# Altium project RadToF.PrjPcb (part 2 of 2)

## Sheet PowerSupply.SchDoc
size B; SheetNumber: 4; SheetTotal: 4
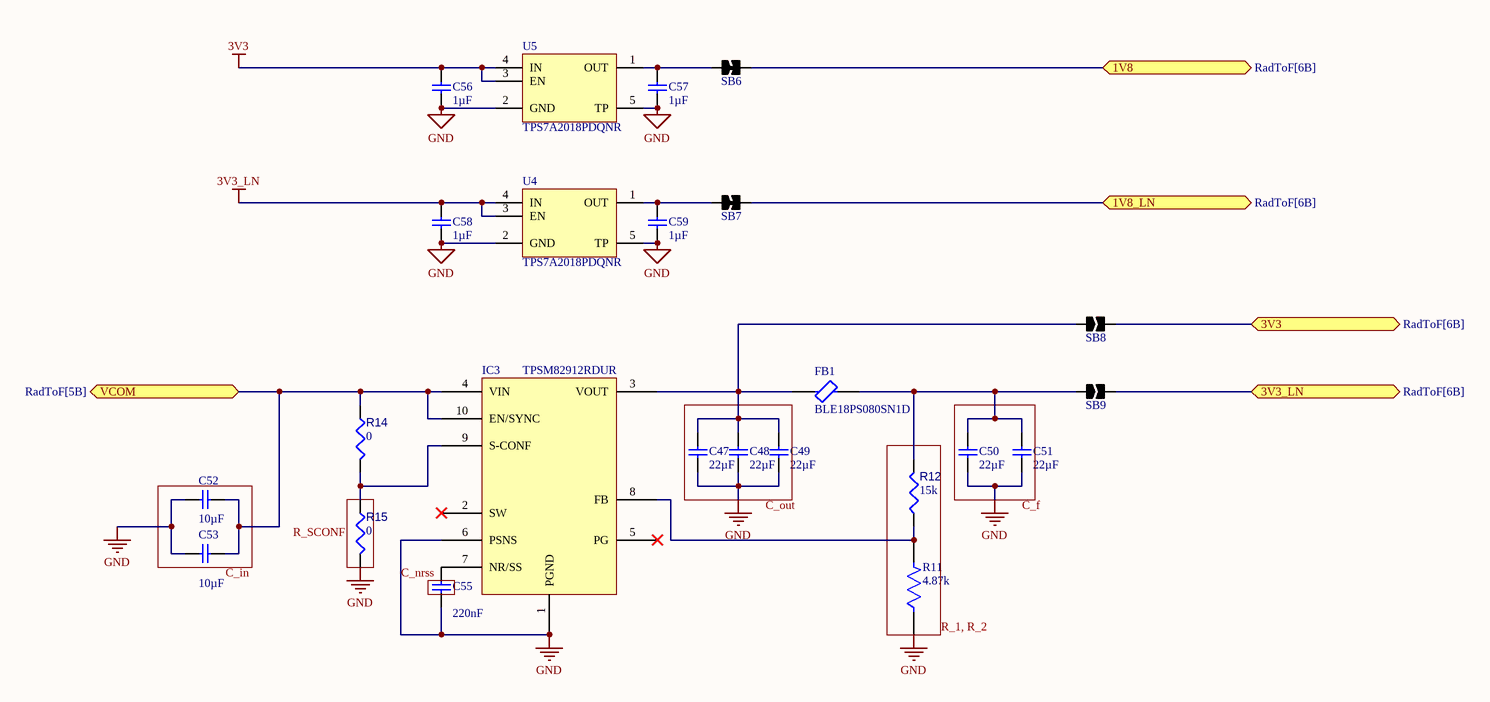
[diagram p3: PowerSupply.SchDoc]

### Parts
C47  value 22µF  [CAP0402]  (hidden comment: C_GRM158R60J226ME01D)
C48  value 22µF  [CAP0402]  (hidden comment: C_GRM158R60J226ME01D)
C49  value 22µF  [CAP0402]  (hidden comment: C_GRM158R60J226ME01D)
C50  value 22µF  [CAP0402]  (hidden comment: C_GRM158R60J226ME01D)
C51  value 22µF  [CAP0402]  (hidden comment: C_GRM158R60J226ME01D)
C52  value 10µF  [CAP0402]  (hidden comment: C_GRM155R61A106ME11D)
C53  value 10µF  [CAP0402]  (hidden comment: C_GRM155R61A106ME11D)
C55  value 220nF  [CAP0201]  (hidden comment: C_GRT033C80J224KE01D)
C56  value 1µF  [CAP0402]  (hidden comment: C_GRM155R61E105KA12J)
C57  value 1µF  [CAP0402]  (hidden comment: C_GRM155R61E105KA12J)
C58  value 1µF  [CAP0402]  (hidden comment: C_GRM155R61E105KA12J)
C59  value 1µF  [CAP0402]  (hidden comment: C_GRM155R61E105KA12J)
FB1  BLE18PS080SN1D  [FP-BLE18-0_15-t0_6-IPC_B]
IC3  TPSM82912RDUR  [TPSM82912RDUR]
R11  4.87k  [FP-RG1005-IPC_C]
R12  value 15k  [RESC1005X40X25ML10T10]  (hidden comment: Resistor 15k +/-1% 0402 63 mW)
R14  value 0  [RESC0402(1005)_L]  (hidden comment: Jumper 0402)
R15  value 0  [RESC0402(1005)_L]  (hidden comment: Jumper 0402)
SB6  SB2_0402_close  [SB2_0402_CLOSE]  (value not drawn)  (net tie)
SB7  SB2_0402_close  [SB2_0402_CLOSE]  (value not drawn)  (net tie)
SB8  SB2_0402  [SB2_0402]  (value not drawn)
SB9  SB2_0402  [SB2_0402]  (value not drawn)
U4  TPS7A2018PDQNR  [DQN0004A_V]
U5  TPS7A2018PDQNR  [DQN0004A_V]

### Ports
1V8 (bidir, see RadToF[6B]), 1V8_LN (bidir, see RadToF[6B]), 3V3 (bidir, see RadToF[6B]), 3V3_LN (bidir, see RadToF[6B]), VCOM (bidir, see RadToF[5B])

### Nets
1V8_LN: SB7.1 ; port 1V8_LN
3V3: C56.2 SB8.1 U5.3(EN) U5.4(IN) ; port 3V3  [project net AVDD]
3V3_LN: C58.2 SB9.1 U4.3(EN) U4.4(IN) ; port 3V3_LN
GND: C47.1 C48.1 C49.1 C50.1 C51.1 C52.1 C53.1 C55.1 C56.1 C57.1 C58.1 C59.1 IC3.1(PGND) IC3.6(PSNS) R11.1 R15.2 U4.2(GND) U4.5(TP) U5.2(GND) U5.5(TP)
IOVDD: SB6.1 ; port 1V8
VCOM: C52.2 C53.2 IC3.4(VIN) IC3.10(EN/SYNC) R14.1 ; port VCOM
NetC47_2: C47.2 C48.2 C49.2 FB1.1 IC3.3(VOUT) SB8.2
NetC50_2: C50.2 C51.2 FB1.2 R12.2 SB9.2
NetC55_2: C55.2 IC3.7(NR/SS)
NetC57_2: C57.2 SB6.2 U5.1(OUT)
NetC59_2: C59.2 SB7.2 U4.1(OUT)
NetIC3_8: IC3.8(FB) R11.2 R12.1
NetIC3_9: IC3.9(S-CONF) R14.2 R15.1

Not connected (* = marked no-connect by the designer): IC3 2(SW)* 5(PG)*

### Notes on the sheet
- (near R15) R_SCONF
- C_out
- C_f
- (near C53) C_in
- (near C55) C_nrss
- (near R11) R_1, R_2

### Library data of the parts
C47-C51 = CMP-001-00107-1: CAP CER 22uF 6.3V X5R 0402; Manufacturer Part Number: GRM155R71H103KA88D; Part Number: GRM033R70J103JA01D; Manufacturer: Murata Electronics; Tolerance: 5%; Capacitor Type: Ceramic; Temperature Characteristics Code: X7R; Rated DC Voltage (URdc): 50V; Multilayer: Yes; Positive Tolerance: 10%; Height: 0.5mm; ComponentLink6Description: https://datasheet.ciiva.com/129/product-129810.pdf?src-supplier=Digi-Key; Package Shape: Rectangular; Pricing 2: 1=0.54000, 10=0.38400, 50=0.38400, 100=0.25300, 1000=0.15900, 10000=0.11200 (USD); Mount: Surface Mount; Terminal Finish: Nickel; Part Status: Active; Length: 1mm; ComponentLink7Description: https://datasheet.ciiva.com/11786/0900766b80ef921d-11786340.pdf?src-supplier=RSComponents; Source: schuluka.SchLib; ComponentLink3Description: https://psearch.en.murata.com:443/capacitor/product/GRM155R71H103KA88%23.pdf?src-supplier=IHS+Markit; Min Operating Temperature: -55°C; Thickness (Max): 0.013" (0.33mm); ComponentLink13URL: https://datasheet.ciiva.com/16495/product-16495290.pdf?src-supplier=Future+Electronics; ComponentLink9Description: https://datasheet.ciiva.com/29199/454225-da-01-en-vs-kondensator-0402-29199740.pdf?src-supplier=Conrad; Size / Dimension: 0.024" L x 0.012" W (0.60mm x 0.30mm); ComponentLink4Description: https://datasheet.ciiva.com/22698/1747449-22698420.pdf?src-supplier=Element14; Width: 0.5mm; LastUpdated: 02/09/2020 01:00:04; ComponentLink10Description: https://datasheet.ciiva.com/129/grm155r71h103ka88-01-129811.pdf?src-supplier=Digi-Key; ComponentLink4URL: https://datasheet.ciiva.com/22698/1747449-22698420.pdf?src-supplier=Element14; Lifecycle Status: Active; Minimum Order: 1; ComponentLink11Description: https://datasheet.ciiva.com/129/grm155r71h103ka88-01-129812.pdf?src-supplier=Digi-Key; ComponentLink8Description: https://datasheet.ciiva.com/18100/getdatasheetpartid-27434-18100660.pdf?src-supplier=Verical; ComponentLink12URL: https://datasheet.ciiva.com/5410/product-5410990.pdf?src-supplier=Mouser; JESD-609 Code: e3; ComponentLink6URL: https://datasheet.ciiva.com/129/product-129810.pdf?src-supplier=Digi-Key; RoHS: Yes; ComponentLink2URL: http://digikey.com/product-detail/en/murata-electronics/GRM033R70J103JA01D/490-16599-1-ND/7595523; Category: Ceramic Capacitors; ComponentLink1Description: Datasheet; ComponentLink10URL: https://datasheet.ciiva.com/129/grm155r71h103ka88-01-129811.pdf?src-supplier=Digi-Key; ComponentLink2Description: DigiKey Link; Termination: Wraparound; Pins: 2; Package Style: SMTMeter; RoHS Compliant: Yes; Price: 0.10; ComponentLink1URL: https://search.murata.co.jp/Ceramy/image/img/A01X/G101/ENG/GRM033R70J103JA01-01.pdf; ComponentLink5Description: https://datasheet.ciiva.com/19476/1856433-19476546.pdf?src-supplier=Jameco; Max Operating Temperature: 125°C; ComponentLink9URL: https://datasheet.ciiva.com/29199/454225-da-01-en-vs-kondensator-0402-29199740.pdf?src-supplier=Conrad; Packaging: CutTape; ComponentLink13Description: https://datasheet.ciiva.com/16495/product-16495290.pdf?src-supplier=Future+Electronics; ComponentLink8URL: https://datasheet.ciiva.com/18100/getdatasheetpartid-27434-18100660.pdf?src-supplier=Verical; Series: GRM; ComponentLink5URL: https://datasheet.ciiva.com/19476/1856433-19476546.pdf?src-supplier=Jameco; Pricing 1: 1=0.10000, 10=0.03200, 50=0.03200, 100=0.01500, 1000=0.00800, 10000=0.00500 (USD); Operating Temperature: -55°C ~ 125°C; Design Item ID: C_GRM158R60J226ME01D; Package / Case: 0201 (0603 Metric); PartId: 174; ComponentLink11URL: https://datasheet.ciiva.com/129/grm155r71h103ka88-01-129812.pdf?src-supplier=Digi-Key; Stock 1: 3320653; Temperature Coefficient: X7R; Stock 2: 132139; ComponentLink7URL: https://datasheet.ciiva.com/11786/0900766b80ef921d-11786340.pdf?src-supplier=RSComponents; ComponentLink3URL: https://psearch.en.murata.com:443/capacitor/product/GRM155R71H103KA88%23.pdf?src-supplier=IHS+Markit; REACH SVHC: Yes; Applications: General Purpose; ComponentLink12Description: https://datasheet.ciiva.com/5410/product-5410990.pdf?src-supplier=Mouser; Negative Tolerance: 10%; Voltage - Rated: 6.3V; Size Code: 0402; Device Package: 0201 (0603 Metric); Mounting Type: Surface Mount, MLCC; Dielectric Material: Ceramic
C52 C53 = CMP-001-00100-1: CAP CER  10uF 10V X5R 20% 0402; Manufacturer: Murata Electronics; Part Number: GRM033R70J103JA01D; Manufacturer Part Number: GRM155R71H103KA88D; Tolerance: 5%; Rated DC Voltage (URdc): 50V; Voltage - Rated: 6.3V; Temperature Coefficient: X7R; Dielectric Material: Ceramic; Negative Tolerance: 10%; Multilayer: Yes; ComponentLink6Description: https://datasheet.ciiva.com/129/product-129810.pdf?src-supplier=Digi-Key; ComponentLink2URL: http://digikey.com/product-detail/en/murata-electronics/GRM033R70J103JA01D/490-16599-1-ND/7595523; Size / Dimension: 0.024" L x 0.012" W (0.60mm x 0.30mm); Lifecycle Status: Active; Terminal Finish: Nickel; ComponentLink12URL: https://datasheet.ciiva.com/5410/product-5410990.pdf?src-supplier=Mouser; Category: Ceramic Capacitors; ComponentLink9URL: https://datasheet.ciiva.com/29199/454225-da-01-en-vs-kondensator-0402-29199740.pdf?src-supplier=Conrad; ComponentLink2Description: DigiKey Link; ComponentLink13Description: https://datasheet.ciiva.com/16495/product-16495290.pdf?src-supplier=Future+Electronics; ComponentLink11Description: https://datasheet.ciiva.com/129/grm155r71h103ka88-01-129812.pdf?src-supplier=Digi-Key; Series: GRM; Source: schuluka.SchLib; ComponentLink8URL: https://datasheet.ciiva.com/18100/getdatasheetpartid-27434-18100660.pdf?src-supplier=Verical; Min Operating Temperature: -55°C; ComponentLink1Description: Datasheet; Thickness (Max): 0.013" (0.33mm); ComponentLink10Description: https://datasheet.ciiva.com/129/grm155r71h103ka88-01-129811.pdf?src-supplier=Digi-Key; Device Package: 0201 (0603 Metric); RoHS Compliant: Yes; Max Operating Temperature: 125°C; Termination: Wraparound; ComponentLink14URL: https://datasheet.ciiva.com:443/pdfs/VipMasterIC/IC/MURE/MURE-S-A0006500741/MURE-S-A0006500741-1.pdf?src-supplier=IHS+Markit; ComponentLink11URL: https://datasheet.ciiva.com/129/grm155r71h103ka88-01-129812.pdf?src-supplier=Digi-Key; ComponentLink5URL: https://datasheet.ciiva.com/19476/1856433-19476546.pdf?src-supplier=Jameco; Width: 0.5mm; Pricing 2: 1=0.17000, 10=0.12400, 50=0.07060, 100=0.05840, 500=0.04098, 1000=0.03392, 2500=0.03157, 5000=0.02888 (USD); ComponentLink6URL: https://datasheet.ciiva.com/129/product-129810.pdf?src-supplier=Digi-Key; ComponentLink13URL: https://datasheet.ciiva.com/16495/product-16495290.pdf?src-supplier=Future+Electronics; Operating Temperature: -55°C ~ 125°C; ComponentLink12Description: https://datasheet.ciiva.com/5410/product-5410990.pdf?src-supplier=Mouser; Stock 1: 3320653; ComponentLink7Description: https://datasheet.ciiva.com/11786/0900766b80ef921d-11786340.pdf?src-supplier=RSComponents; Pins: 2; ComponentLink14Description: https://datasheet.ciiva.com:443/pdfs/VipMasterIC/IC/MURE/MURE-S-A0006500741/MURE-S-A0006500741-1.pdf?src-supplier=IHS+Markit; Length: 1mm; ComponentLink4Description: https://datasheet.ciiva.com/22698/1747449-22698420.pdf?src-supplier=Element14; Part Status: Active; Design Item ID: C_GRM155R61A106ME11D; Price: 0.10; ComponentLink10URL: https://datasheet.ciiva.com/129/grm155r71h103ka88-01-129811.pdf?src-supplier=Digi-Key; Stock 2: 66098; Package / Case: 0201 (0603 Metric); Positive Tolerance: 10%; PartId: 174; JESD-609 Code: e3; Package Style: SMTMeter; Applications: General Purpose; Package Shape: Rectangular; Pricing 1: 1=0.10000, 10=0.03200, 50=0.03200, 100=0.01500, 1000=0.00800, 10000=0.00500 (USD); ComponentLink3Description: https://psearch.en.murata.com:443/capacitor/product/GRM155R71H103KA88%23.pdf?src-supplier=IHS+Markit; RoHS: Yes; Temperature Characteristics Code: X7R; Packaging: CutTape; Minimum Order: 1; Mount: Surface Mount; Capacitor Type: Ceramic; ComponentLink3URL: https://psearch.en.murata.com:443/capacitor/product/GRM155R71H103KA88%23.pdf?src-supplier=IHS+Markit; ComponentLink4URL: https://datasheet.ciiva.com/22698/1747449-22698420.pdf?src-supplier=Element14; REACH SVHC: Yes; Height: 0.5mm; LastUpdated: 02/09/2020 01:00:04; ComponentLink8Description: https://datasheet.ciiva.com/18100/getdatasheetpartid-27434-18100660.pdf?src-supplier=Verical; Size Code: 0402; Reach SVHC Compliant: Yes; ComponentLink5Description: https://datasheet.ciiva.com/19476/1856433-19476546.pdf?src-supplier=Jameco; ComponentLink7URL: https://datasheet.ciiva.com/11786/0900766b80ef921d-11786340.pdf?src-supplier=RSComponents; ComponentLink1URL: https://search.murata.co.jp/Ceramy/image/img/A01X/G101/ENG/GRM033R70J103JA01-01.pdf; ComponentLink9Description: https://datasheet.ciiva.com/29199/454225-da-01-en-vs-kondensator-0402-29199740.pdf?src-supplier=Conrad; Mounting Type: Surface Mount, MLCC
C55 = CMP-001-00110-1: CAP CER 0.22uF 6.3V X6S 0201; Manufacturer: Murata Electronics; Tolerance: 10%; Packaging: TapeAndReel; Package / Case: 0201 (0603 Metric); Applications: Automotive; LastUpdated: 02/09/2020 00:58:08; Source: schuluka.SchLib; Design Item ID: C_GRT033C80J224KE01D; PartId: 1513; ComponentLink1Description: Datasheet; Operating Temperature: -55°C ~ 105°C; Price: 0.01; Thickness (Max): 0.013" (0.33mm); Voltage - Rated: 6.3V; Features: Derating Recommended; Temperature Coefficient: X6S; ComponentLink2Description: DigiKey Link; Lifecycle Status: Active; Device Package: 0201 (0603 Metric); Minimum Order: 1; Ratings: AEC-Q200; ComponentLink2URL: http://digikey.com/product-detail/en/murata-electronics/GRT033C80J224KE01D/490-12230-1-ND/5416931; ComponentLink1URL: https://search.murata.co.jp/Ceramy/image/img/A01X/G101/ENG/GRT033C80J224KE01-01.pdf; Series: GRT; Mounting Type: Surface Mount, MLCC; Size / Dimension: 0.024" L x 0.012" W (0.60mm x 0.30mm); Part Status: Active; Part Number: GRT033C80J224KE01D
C56-C59 = CMP-001-00102-1: CAP CER 1uF 25V X5R 0402; Manufacturer Part Number: GRM033R61A105ME15D; Manufacturer: Murata; Positive Tolerance: 10%; Voltage Rating (DC): 10V; Dielectric Material: Ceramic; Multilayer: Yes; Tolerance: 20%; Pricing 1: 1=0.18000, 10=0.08400, 50=0.08400, 100=0.03800, 1000=0.02100, 10000=0.01600 (USD); Pins: 2; Termination: Wraparound; Thickness: 0.015inch; Case Code (Metric): 0603; Packaging: Tape and Reel; Temperature Characteristics Code: X5R; Package Shape: Rectangular; ComponentLink2Description: https://datasheet.ciiva.com:443/pdfs/VipMasterIC/IC/MURE/MURE-S-A0004362469/MURE-S-A0004364524-1.pdf?src-supplier=IHS+Markit; ComponentLink1URL: http://search.murata.co.jp/Ceramy/image/img/A01X/G101/ENG/GRM033R61A105ME15-01.pdf?src-supplier=Digi-Key; Case/Package: 0201; Terminal Finish: Nickel; Height: 0.5mm; ComponentLink2URL: https://datasheet.ciiva.com:443/pdfs/VipMasterIC/IC/MURE/MURE-S-A0004362469/MURE-S-A0004364524-1.pdf?src-supplier=IHS+Markit; ComponentLink3URL: http://search.murata.co.jp/Ceramy/image/img/A01X/G101/ENG/GRM155R61E105KA12-01.pdf?src-supplier=Digi-Key; Size Code: 0402; Source: schuluka.SchLib; Max Operating Temperature: 85°C; Category: Ceramic Capacitors; Width: 0.012inch; REACH SVHC: Yes; Min Operating Temperature: -55°C; Dielectric: X5R; ComponentLink3Description: http://search.murata.co.jp/Ceramy/image/img/A01X/G101/ENG/GRM155R61E105KA12-01.pdf?src-supplier=Digi-Key; Mount: Surface Mount; Rated DC Voltage (URdc): 25V; Stock 1: 645001; Voltage Rating: 10V; RoHS Compliant: Yes; Design Item ID: C_GRM155R61E105KA12J; Capacitor Type: Ceramic; JESD-609 Code: e3; RoHS: Yes; ComponentLink1Description: http://search.murata.co.jp/Ceramy/image/img/A01X/G101/ENG/GRM033R61A105ME15-01.pdf?src-supplier=Digi-Key; Package Style: SMTMeter; Negative Tolerance: 10%; Length: 0.024inch
FB1 = CMP-06046-000742-1: Ferrite Chip Bead 8A 8.5Ohm 2-Pin 0603 Paper T/R
IC3 = TPSM82912RDUR: Switching Voltage Regulators 17-V, 2-A low-noise and low-ripple buck module with integrated ferrite bead filter compensation 28-B0QFN -40 to 125
R11 = CMP-28537-004237-1: Automotive Metal Thin Film Chip Resistor, 0402, 4.87kΩ, 0.1%, 25ppm/°C, 0.0625W, 75V; Max Power Dissipation: 63mW; Voltage Rating (DC): 25V; Resistance: 4.87kR; Resistor Type: Thin Film; RoHS Compliant: Yes; Case Code (Imperial): 0402; Package Quantity: 5000; Max Operating Temperature: 155°C; Termination: SMD/SMT; Series: RG; Min Operating Temperature: -55°C; Size Code: 0402; Length: 0.039inch; Power Rating: 63mW; Number of Terminations: 2; Packaging: Tape and Reel; Temperature Coefficient: 25ppm/°C; Features: Automotive AEC-Q200; Case Code (Metric): 1005; Voltage Rating: 75V; Height: 0.016inch; Width: 0.5mm; Tolerance: 0.1%; Weight: 2.3E-05oz; Case/Package: 0402; Lead Free: Lead Free
R12 = CMP-009-00026-5: Chip Resistor, 15 KOhm, +/- 1%, 0.063 W, -55 to 155 degC, 0402 (1005 Metric); Power: 63mW; Min Operating Temperature: -55°C; Tolerance: 1%; Max Operating Temperature: 155°C; Mounting Technology: SM; Case/Package: 0402; RoHS Compliant: True; Pins: 2
R14 R15 = CMP-009-00148-3: Pins: 2; Max Operating Temperature: 155°C; Min Operating Temperature: -55°C; Case/Package: 0402
SB6 SB7 = JUMP_SB2_0402_close: Custom Solder jumper, closed
SB8 SB9 = JUMP_SB2_0402: Custom Solder jumper, open
U4 U5 = LDO_TPS7A2018PDQNR: 1.8V 300-mA ultra-low-noise low-IQ low-dropout (LDO) linear regulator with high PSRR; Manufacturer: Texas Instruments; Supplier 1: Mouser; Manufacturer Part Number: TPS7A2018PDQNR; RoHS: No; Category: Integrated Circuits (ICs); Stock 1: 10388; Pricing 1: 1=0.46, 10=0.371, 50=0.371, 100=0.276, 1000=0.181, 10000=0.145 (USD); Supplier Part Number 1: 595-TPS7A2018PDQNR

## Nets that join several sheets
1V8_LN: DS (9 pins), FS (9 pins), PowerSupply (SB7.1)
3V3_LN: DS (C6_DS.2 L1_DS.1 P1_DS.1), FS (C6_FS.2 L1_FS.1 P1_FS.1), PowerSupply (C58.2 SB9.1 U4.3 U4.4)
AVDD: RadToF (8 pins), DS (C5_DS.2 P4_DS.1 U2_DS.C4), FS (C5_FS.2 P4_FS.1 U2_FS.C4), PowerSupply (C56.2 SB8.1 U5.3 U5.4)
GND: RadToF (32 pins), DS (53 pins), FS (53 pins), OSC_F (C42_OSC_F.1 C43_OSC_F.1 Y1_OSC_F.2), PowerSupply (20 pins), OSC_D (C42_OSC_D.1 C43_OSC_D.1 Y1_OSC_D.2)
IOVDD: RadToF (20 pins), DS (10 pins), FS (10 pins), OSC_F (C42_OSC_F.2 C43_OSC_F.2 SB1_OSC_F.2 Y1_OSC_F.4), PowerSupply (SB6.1), OSC_D (C42_OSC_D.2 C43_OSC_D.2 SB1_OSC_D.2 Y1_OSC_D.4)
NetU1_DS_M4: DS (U1_DS.M4), OSC_D (Y1_OSC_D.3)
NetU1_FS_M4: FS (U1_FS.M4), OSC_F (Y1_OSC_F.3)
~{RADAR1_RST}: RadToF (IC1.2), DS (U1_DS.F1)
~{RADAR2_RST}: RadToF (IC1.14), FS (U1_FS.F1)
RADAR1_CSN: RadToF (IC1.4), DS (U1_DS.G1)
RADAR1_IQR: RadToF (IC1.3), DS (U1_DS.C1)
RADAR1_MISO: RadToF (IC1.22 P7.1), DS (U1_DS.E1)
RADAR1_MOSI: RadToF (IC1.23 P8.1), DS (U1_DS.D1)
RADAR1_SCK: RadToF (IC1.21), DS (U1_DS.B1)
RADAR2_CSN: RadToF (IC1.16), FS (U1_FS.G1)
RADAR2_IQR: RadToF (IC1.15), FS (U1_FS.C1)
RADAR2_MISO: RadToF (IC1.10 P5.1), FS (U1_FS.E1)
RADAR2_MOSI: RadToF (IC1.9 P6.1), FS (U1_FS.D1)
RADAR2_SCK: RadToF (IC1.29), FS (U1_FS.B1)
ToF1_CSN: RadToF (IC1.40), DS (R1_DS.1 U2_DS.C2)
ToF1_INT: RadToF (IC1.41), DS (R3_DS.1 U2_DS.A1)
ToF1_SYNC: RadToF (IC1.42), DS (R4_DS.1 U2_DS.B1)
ToF2_CSN: RadToF (IC1.37), FS (R1_FS.1 U2_FS.C2)
ToF2_INT: RadToF (IC1.38), FS (R3_FS.1 U2_FS.A1)
ToF2_SYNC: RadToF (IC1.39), FS (R4_FS.1 U2_FS.B1)
ToF_MISO: RadToF (IC1.55 R6.1), DS (U2_DS.C5), FS (U2_FS.C5)
ToF_MOSI: RadToF (IC1.28), DS (U2_DS.A4), FS (U2_FS.A4)
ToF_SCK: RadToF (IC1.54), DS (U2_DS.A5), FS (U2_FS.A5)
VCOM: RadToF (J2.9), PowerSupply (5 pins)